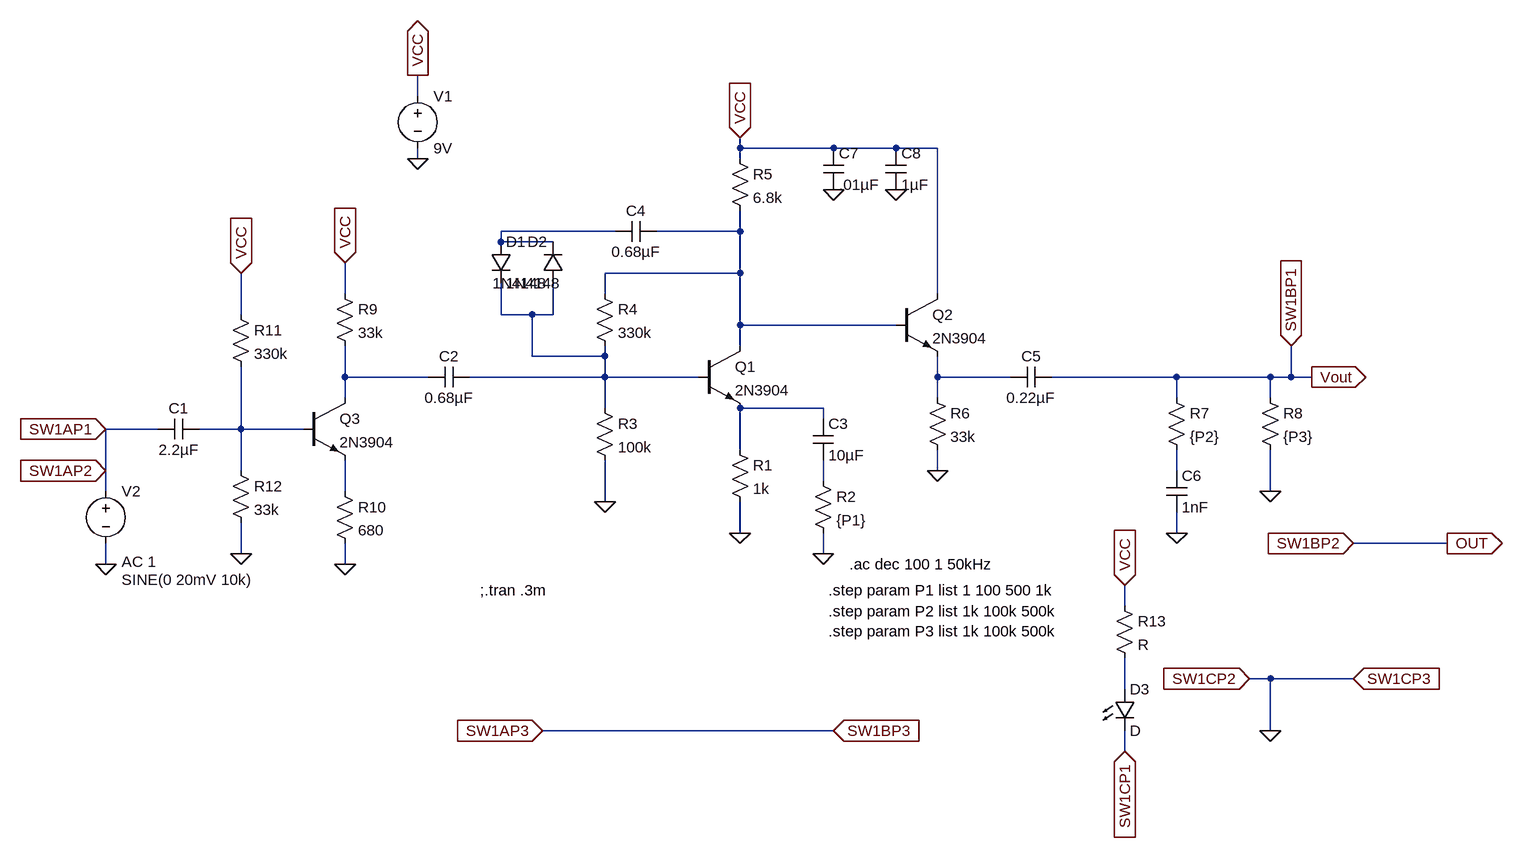
[diagram p0: schematic 2stageODpedal.asc]
2stageODpedal.asc, the LTspice schematic file:
Version 4
SHEET 1 1156 908
WIRE -544 -256 -544 -288
WIRE -48 -176 -48 -192
WIRE 96 -176 -48 -176
WIRE 192 -176 96 -176
WIRE 256 -176 192 -176
WIRE -544 -160 -544 -176
WIRE -48 -160 -48 -176
WIRE -240 -48 -416 -48
WIRE -48 -48 -48 -80
WIRE -48 -48 -176 -48
WIRE -416 -32 -416 -48
WIRE -336 -32 -416 -32
WIRE -48 16 -48 -48
WIRE -48 16 -256 16
WIRE -656 48 -656 0
WIRE -256 48 -256 16
WIRE 256 48 256 -176
WIRE -816 80 -816 16
WIRE -416 80 -416 32
WIRE -368 80 -416 80
WIRE -336 80 -336 32
WIRE -336 80 -368 80
WIRE -48 96 -48 16
WIRE 192 96 -48 96
WIRE -48 128 -48 96
WIRE -368 144 -368 80
WIRE -256 144 -256 128
WIRE -256 144 -368 144
WIRE -656 176 -656 128
WIRE -528 176 -656 176
WIRE -256 176 -256 144
WIRE -256 176 -464 176
WIRE -112 176 -256 176
WIRE 256 176 256 144
WIRE 368 176 256 176
WIRE 624 176 432 176
WIRE 768 176 624 176
WIRE 800 176 800 128
WIRE 800 176 768 176
WIRE 832 176 800 176
WIRE -656 208 -656 176
WIRE 256 208 256 176
WIRE 624 208 624 176
WIRE 768 208 768 176
WIRE -256 224 -256 176
WIRE 80 224 -48 224
WIRE 80 240 80 224
WIRE -944 256 -1024 256
WIRE -816 256 -816 160
WIRE -816 256 -880 256
WIRE -720 256 -816 256
WIRE -48 288 -48 224
WIRE -1024 320 -1024 256
WIRE -816 320 -816 256
WIRE 256 320 256 288
WIRE 624 320 624 288
WIRE 80 336 80 304
WIRE -1024 352 -1024 320
WIRE -656 352 -656 304
WIRE 768 352 768 288
WIRE -256 368 -256 304
WIRE -48 416 -48 368
WIRE 624 416 624 384
WIRE 1040 432 896 432
WIRE -816 448 -816 400
WIRE 80 448 80 416
WIRE -1024 464 -1024 432
WIRE -656 464 -656 432
WIRE 544 528 544 496
WIRE 768 640 736 640
WIRE 896 640 768 640
WIRE 544 656 544 608
WIRE 96 720 -352 720
WIRE 768 720 768 640
WIRE 544 752 544 720
FLAG 80 448 0
FLAG -48 416 0
FLAG -256 368 0
FLAG -544 -160 0
FLAG -544 -288 VCC
IOPIN -544 -288 Out
FLAG -48 -192 VCC
IOPIN -48 -192 In
FLAG 256 320 0
FLAG 624 416 0
FLAG 768 352 0
FLAG 832 176 Vout
IOPIN 832 176 Out
FLAG 96 -112 0
FLAG 192 -112 0
FLAG -656 464 0
FLAG -656 0 VCC
IOPIN -656 0 In
FLAG -1024 464 0
FLAG -816 448 0
FLAG -816 16 VCC
IOPIN -816 16 In
FLAG -1024 256 SW1AP1
IOPIN -1024 256 In
FLAG -352 720 SW1AP3
IOPIN -352 720 In
FLAG 96 720 SW1BP3
IOPIN 96 720 In
FLAG -1024 320 SW1AP2
IOPIN -1024 320 In
FLAG 896 432 SW1BP2
IOPIN 896 432 In
FLAG 1040 432 OUT
IOPIN 1040 432 Out
FLAG 800 128 SW1BP1
IOPIN 800 128 In
FLAG 544 496 VCC
IOPIN 544 496 In
FLAG 544 752 SW1CP1
IOPIN 544 752 In
FLAG 768 720 0
FLAG 736 640 SW1CP2
IOPIN 736 640 In
FLAG 896 640 SW1CP3
IOPIN 896 640 In
SYMBOL npn -112 128 R0
SYMATTR InstName Q1
SYMATTR Value 2N3904
SYMBOL npn 192 48 R0
SYMATTR InstName Q2
SYMATTR Value 2N3904
SYMBOL res -64 272 R0
SYMATTR InstName R1
SYMATTR Value 1k
SYMBOL res 64 320 R0
SYMATTR InstName R2
SYMATTR Value {P1}
SYMBOL cap 64 240 R0
SYMATTR InstName C3
SYMATTR Value 10µF
SYMBOL res -272 208 R0
SYMATTR InstName R3
SYMATTR Value 100k
SYMBOL res -272 32 R0
SYMATTR InstName R4
SYMATTR Value 330k
SYMBOL res -64 -176 R0
SYMATTR InstName R5
SYMATTR Value 6.8k
SYMBOL voltage -544 -272 R0
WINDOW 123 0 0 Left 0
WINDOW 39 0 0 Left 0
SYMATTR InstName V1
SYMATTR Value 9V
SYMBOL cap -176 -64 R90
WINDOW 0 0 32 VBottom 2
WINDOW 3 32 32 VTop 2
SYMATTR InstName C4
SYMATTR Value 0.68µF
SYMBOL diode -432 -32 R0
SYMATTR InstName D1
SYMATTR Value 1N4148
SYMBOL diode -320 32 R180
WINDOW 0 24 64 Left 2
WINDOW 3 24 0 Left 2
SYMATTR InstName D2
SYMATTR Value 1N4148
SYMBOL res 240 192 R0
SYMATTR InstName R6
SYMATTR Value 33k
SYMBOL cap 432 160 R90
WINDOW 0 0 32 VBottom 2
WINDOW 3 32 32 VTop 2
SYMATTR InstName C5
SYMATTR Value 0.22µF
SYMBOL res 608 192 R0
SYMATTR InstName R7
SYMATTR Value {P2}
SYMBOL res 752 192 R0
SYMATTR InstName R8
SYMATTR Value {P3}
SYMBOL cap 608 320 R0
SYMATTR InstName C6
SYMATTR Value 1nF
SYMBOL cap 80 -176 R0
SYMATTR InstName C7
SYMATTR Value .01µF
SYMBOL cap 176 -176 R0
SYMATTR InstName C8
SYMATTR Value 1µF
SYMBOL npn -720 208 R0
SYMATTR InstName Q3
SYMATTR Value 2N3904
SYMBOL res -672 32 R0
SYMATTR InstName R9
SYMATTR Value 33k
SYMBOL cap -464 160 R90
WINDOW 0 0 32 VBottom 2
WINDOW 3 32 32 VTop 2
SYMATTR InstName C2
SYMATTR Value 0.68µF
SYMBOL res -672 336 R0
SYMATTR InstName R10
SYMATTR Value 680
SYMBOL cap -880 240 R90
WINDOW 0 0 32 VBottom 2
WINDOW 3 32 32 VTop 2
SYMATTR InstName C1
SYMATTR Value 2.2µF
SYMBOL voltage -1024 336 R0
WINDOW 3 24 152 Left 2
WINDOW 123 24 124 Left 2
WINDOW 39 0 0 Left 0
SYMATTR InstName V2
SYMATTR Value SINE(0 20mV 10k)
SYMATTR Value2 AC 1
SYMBOL res -832 64 R0
SYMATTR InstName R11
SYMATTR Value 330k
SYMBOL res -832 304 R0
SYMATTR InstName R12
SYMATTR Value 33k
SYMBOL res 528 512 R0
SYMATTR InstName R13
SYMBOL LED 528 656 R0
SYMATTR InstName D3
TEXT 88 504 Left 2 !.step param P1 list 1 100 500 1k
TEXT 120 464 Left 2 !.ac dec 100 1 50kHz
TEXT 88 536 Left 2 !.step param P2 list 1k 100k 500k\n.step param P3 list 1k 100k 500k
TEXT -448 504 Left 2 !;.tran .3m

The netlist it stands for:
* 2stageODpedal.asc
Q1 N002 N003 N006 0 2N3904
Q2 VCC N002 N005 0 2N3904
R1 N006 0 1k
R2 N009 0 {P1}
C3 N006 N009 10µF
R3 N003 0 100k
R4 N002 N003 330k
R5 VCC N002 6.8k
V1 VCC 0 9V
C4 N002 N001 0.68µF
D1 N001 N003 1N4148
D2 N003 N001 1N4148
R6 N005 0 33k
C5 SW1BP1 N005 0.22µF
R7 SW1BP1 N008 {P2}
R8 SW1BP1 0 {P3}
C6 N008 0 1nF
C7 VCC 0 .01µF
C8 VCC 0 1µF
Q3 N004 N007 N010 0 2N3904
R9 VCC N004 33k
C2 N003 N004 0.68µF
R10 N010 0 680
C1 N007 SW1AP2 2.2µF
V2 SW1AP2 0 SINE(0 20mV 10k) AC 1
R11 VCC N007 330k
R12 N007 0 33k
R13 VCC N011 R
D3 N011 SW1CP1 D
.model D D
.lib standard.dio
.model NPN NPN
.model PNP PNP
.lib standard.bjt
.step param P1 list 1 100 500 1k
.ac dec 100 1 50kHz
.step param P2 list 1k 100k 500k
.step param P3 list 1k 100k 500k
;.tran .3m
.backanno
.end